# Altium project Expansion_S6.PrjPcb
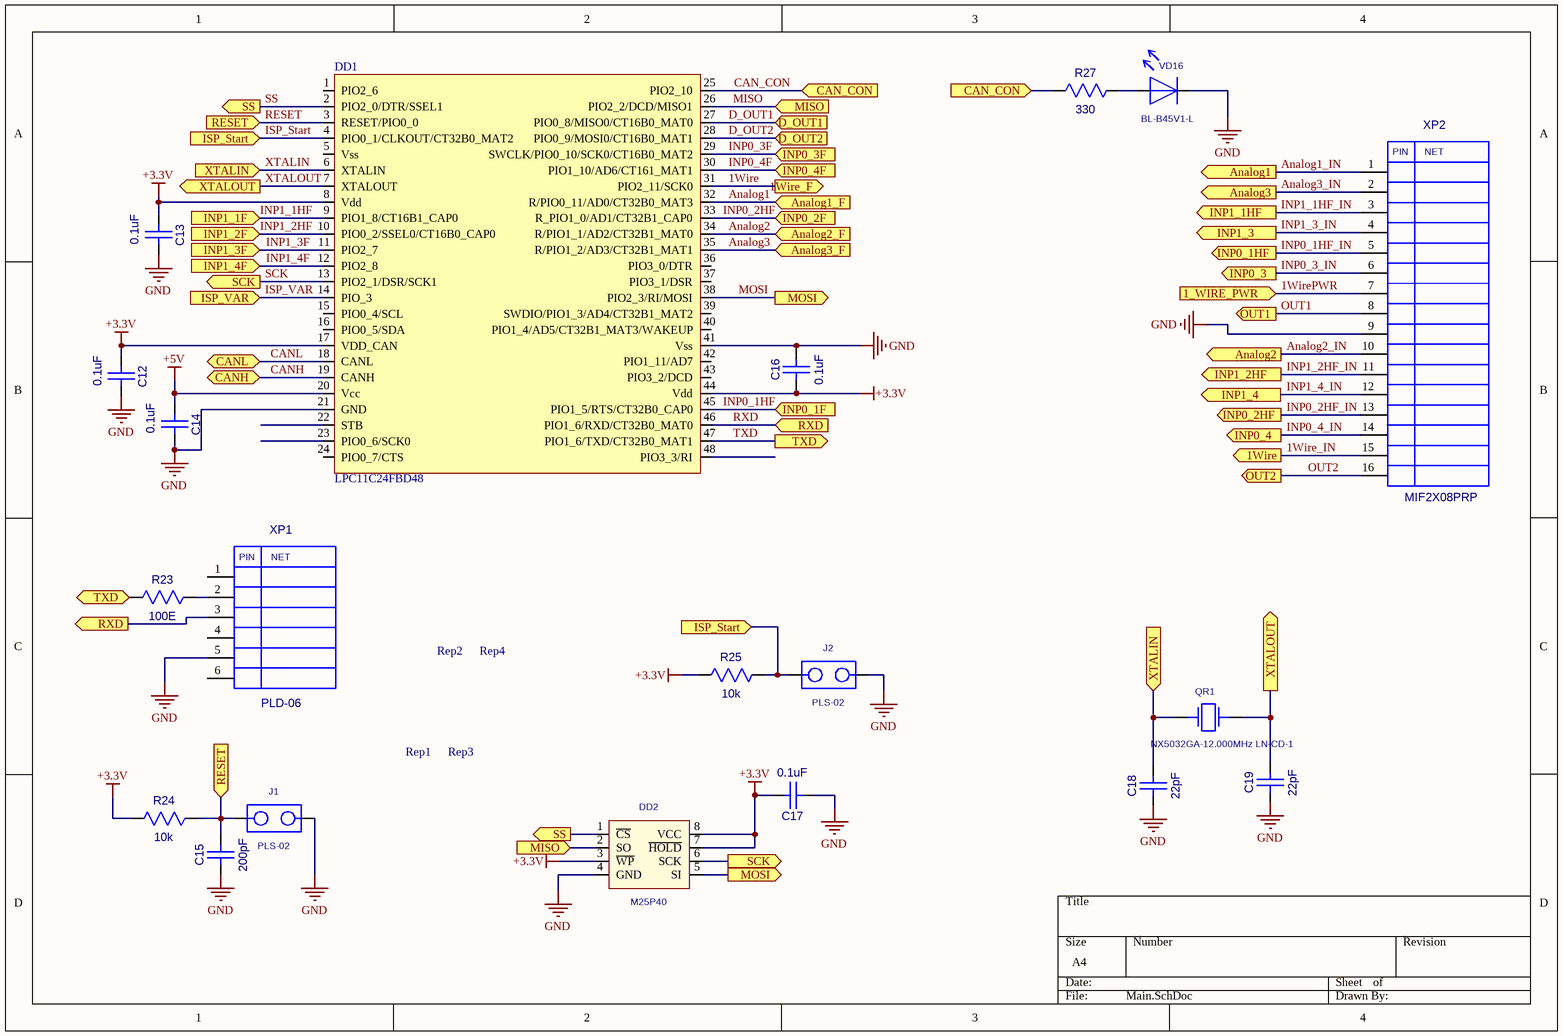
[diagram p0: Main.SchDoc]
6 sheets, 127 parts. Net scope: flat (ports and power ports of the same name join across sheets).
Board file: ExpansionS6_PCB.PcbDoc
Sheets:
  Main.SchDoc
  Power.SchDoc
  Input.SchDoc
  Input_1.SchDoc
  Input_0.SchDoc
  Output&1Wire.SchDoc

## Sheet Main.SchDoc
size A4

### Parts
C12  0.1uF  [CC0603-3M]
C13  0.1uF  [CC0603-3M]
C14  0.1uF  [CC0603-3M]
C15  200pF  [CC0603-3M]
C16  0.1uF  [CC0603-3M]
C17  0.1uF  [CC0603-3M]
C18  22pF  [CC0603-3M]
C19  22pF  [CC0603-3M]
DD1  LPC11C24FBD48  [LQFP48]
DD2  M25P40  [EIAJ_SO8]
J1  PLS-02  [PIN2W]
J2  PLS-02  [PIN2W]
QR1  NX5032GA-12.000MHz LN-CD-1  [AC5032_2]
R23  100E  [RC0603-3M]
R24  10k  [RC0603-3M]
R25  10k  [RC0603-3M]
R27  330  [RC0603-3M]
Rep1  REPER1.2  [REPER1.2]  (value not drawn)
Rep2  REPER1.2  [REPER1.2]  (value not drawn)
Rep3  REPER1.2  [REPER1.2]  (value not drawn)
Rep4  REPER1.2  [REPER1.2]  (value not drawn)
VD16  BL-B45V1-L  [LED3]
XP1  PLD-06  [PIN6]
XP2  MIF2X08PRP  [MIF2X08PRP]

### Ports
1_WIRE_PWR (in), 1Wire (out), 1Wire_F (out), Analog1 (out), Analog1_F (in), Analog2 (out), Analog2_F (in), Analog3 (out), Analog3_F (in), CAN_CON (in), CANH, CANL, D_OUT1 (in), D_OUT2 (in), INP0_1F (in), INP0_1HF (out), INP0_2F (in), INP0_2HF (out), INP0_3 (out), INP0_3F (in), INP0_4 (out), INP0_4F (in), INP1_1F (in), INP1_1HF (out), INP1_2F (in), INP1_2HF (out), INP1_3 (out), INP1_3F (in), INP1_4 (out), INP1_4F (in), ISP_Start (in), ISP_VAR (in), MISO (in), MOSI (out), OUT1 (out), OUT2 (out), RESET (in), RXD (in), RXD (out), SCK (out), SS (out), TXD (in), TXD (out), XTALIN (in), XTALOUT (out)

### Nets
+3.3V: C12.1(A) C13.1(A) C16.1(A) C17.2(B) DD1.8(Vdd) DD1.17(VDD_CAN) DD1.44(Vdd) DD2.3(~{WP}) DD2.7(~{HOLD}) DD2.8(VCC) R24.1(A) R25.1(A)
+5V: C14.1(A) DD1.20(Vcc)
GND: C12.2(B) C13.2(B) C14.2(B) C15.1(A) C16.2(B) C17.1(A) C18.1(A) C19.1(A) DD1.21(GND) DD1.41(Vss) DD2.4(GND) J1.2 J2.2 VD16.1 XP1.5 XP2.9
1Wire: DD1.31(PIO2_11/SCK0) ; port 1Wire_F
1Wire_IN: XP2.15 ; port 1Wire
1WirePWR: XP2.7 ; port 1_WIRE_PWR
Analog1: DD1.32(R/PIO0_11/AD0/CT32B0_MAT3) ; port Analog1_F
Analog1_IN: XP2.1 ; port Analog1
Analog2: DD1.34(R/PIO1_1/AD2/CT32B1_MAT0) ; port Analog2_F
Analog2_IN: XP2.10 ; port Analog2
Analog3: DD1.35(R/PIO1_2/AD3/CT32B1_MAT1) ; port Analog3_F
Analog3_IN: XP2.2 ; port Analog3
CAN_CON: DD1.25(PIO2_10) R27.1(A) ; port CAN_CON
CANH: DD1.19(CANH) ; port CANH
CANL: DD1.18(CANL) ; port CANL
D_OUT1: DD1.27(PIO0_8/MISO0/CT16B0_MAT0) ; port D_OUT1
D_OUT2: DD1.28(PIO0_9/MOSI0/CT16B0_MAT1) ; port D_OUT2
INP0_1HF: DD1.45(PIO1_5/RTS/CT32B0_CAP0) ; port INP0_1F
INP0_1HF_IN: XP2.5 ; port INP0_1HF
INP0_2HF: DD1.33(R_PIO1_0/AD1/CT32B1_CAP0) ; port INP0_2F
INP0_2HF_IN: XP2.13 ; port INP0_2HF
INP0_3_IN: XP2.6 ; port INP0_3
INP0_3F: DD1.29(SWCLK/PIO0_10/SCK0/CT16B0_MAT2) ; port INP0_3F
INP0_4_IN: XP2.14 ; port INP0_4
INP0_4F: DD1.30(PIO1_10/AD6/CT161_MAT1) ; port INP0_4F
INP1_1HF: DD1.9(PIO1_8/CT16B1_CAP0) ; port INP1_1F
INP1_1HF_IN: XP2.3 ; port INP1_1HF
INP1_2HF: DD1.10(PIO0_2/SSEL0/CT16B0_CAP0) ; port INP1_2F
INP1_2HF_IN: XP2.11 ; port INP1_2HF
INP1_3_IN: XP2.4 ; port INP1_3
INP1_3F: DD1.11(PIO2_7) ; port INP1_3F
INP1_4_IN: XP2.12 ; port INP1_4
INP1_4F: DD1.12(PIO2_8) ; port INP1_4F
ISP_Start: DD1.4(PIO0_1/CLKOUT/CT32B0_MAT2) J2.1 R25.2(B) ; port ISP_Start
ISP_VAR: DD1.14(PIO_3) ; port ISP_VAR
MISO: DD1.26(PIO2_2/DCD/MISO1) DD2.2(SO) ; port MISO
MOSI: DD1.38(PIO2_3/RI/MOSI) DD2.5(SI) ; port MOSI
OUT1: XP2.8 ; port OUT1
OUT2: XP2.16 ; port OUT2
RESET: C15.2(B) DD1.3(RESET/PIO0_0) J1.1 R24.2(B) ; port RESET
RXD: DD1.46(PIO1_6/RXD/CT32B0_MAT0) XP1.3 ; port RXD
SCK: DD1.13(PIO2_1/DSR/SCK1) DD2.6(SCK) ; port SCK
SS: DD1.2(PIO2_0/DTR/SSEL1) DD2.1(~{CS}) ; port SS
TXD: DD1.47(PIO1_6/TXD/CT32B0_MAT1) R23.1(A) ; port TXD
XTALIN: C18.2(B) DD1.6(XTALIN) QR1.1 ; port XTALIN
XTALOUT: C19.2(B) DD1.7(XTALOUT) QR1.2 ; port XTALOUT
NetR23_2: R23.2(B) XP1.2
NetR27_2: R27.2(B) VD16.2

Not connected (* = marked no-connect by the designer): DD1 1(PIO2_6) 5(Vss) 15(PIO0_4/SCL) 16(PIO0_5/SDA) 22(STB) 23(PIO0_6/SCK0) 24(PIO0_7/CTS) 36(PIO3_0/DTR) 37(PIO3_1/DSR) 39(SWDIO/PIO1_3/AD4/CT32B1_MAT2) 40(PIO1_4/AD5/CT32B1_MAT3/WAKEUP) 42(PIO1_11/AD7) 43(PIO3_2/DCD) 48(PIO3_3/RI); Rep1 1; Rep2 1; Rep3 1; Rep4 1; XP1 1 4 6

### Notes on the sheet
- (in symbol MIF2X08PRP) PIN; NET
- (in symbol PLD-06) PIN; NET

### Library data of the parts
C12-C19 = CC0603
  C12-C14 C16 C17: Value: 0.1uF
  C15: Value: 200pF
  C18 C19: Value: 22pF
DD2 = S25FL016A0LMFI01: Value: M25P40
QR1 = AC5032_2: AC5032/2; Value: NX5032GA-12.000MHz LN-CD-1
R23-R25 R27 = RC0603
  R23: Value: 100E
  R24 R25: Value: 10k
  R27: Value: 330
VD16 = LED_3: Value: BL-B45V1-L
XP1 = PLD-06: PLD06; Value: *
DD1 = LPC11C24FBD48: Value: LPC11C24FBD48
J1 J2 = PLS-02: Value: *
Rep1-Rep4 = REPER1.2: Value: *
XP2 = MIF2X08PRP: Value: *

## Sheet Power.SchDoc
size A4
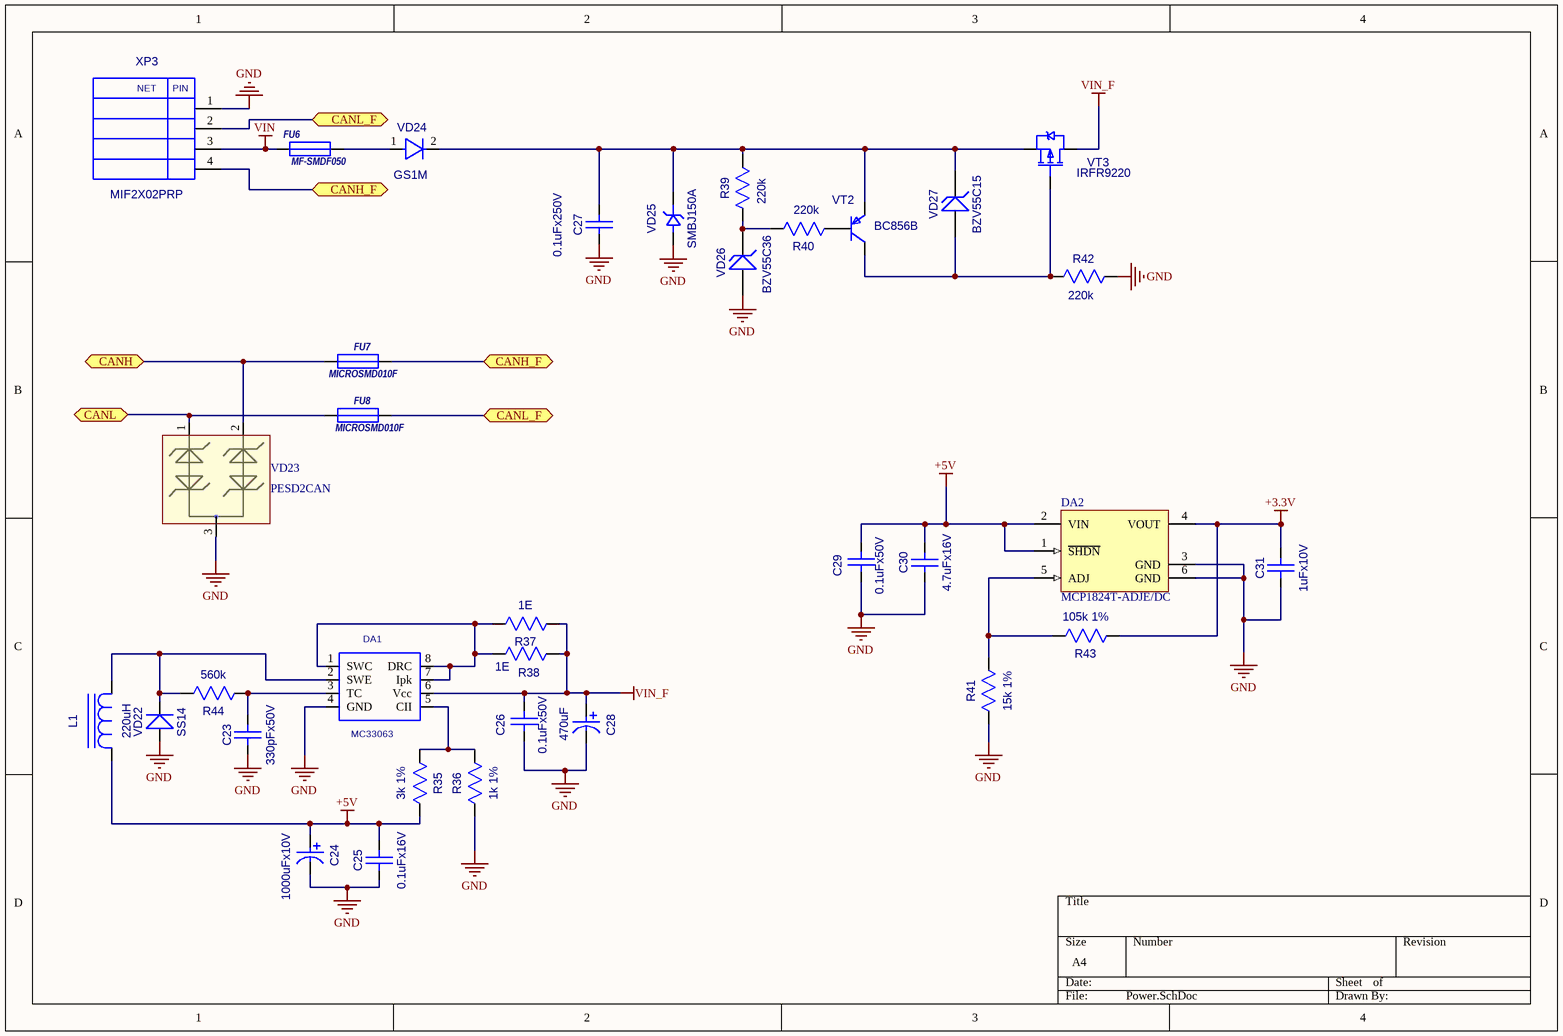
[diagram p1: Power.SchDoc]

### Parts
C23  330pFx50V  [CC0603-3M]
C24  1000uFx10V  [CC8X3.5]
C25  0.1uFx16V  [CC0603-3M]
C26  0.1uFx50V  [CC0603-3M]
C27  0.1uFx250V  [CC1206-MIDI]
C28  470uF  [CC16X10_CAP0.5(1)(Primary)]
C29  0.1uFx50V  [CC0603-3M]
C30  4.7uFx16V  [CC0805-MIDI-2M1]
C31  1uFx10V  [CC0603-3M]
DA1  MC33063  [SO-8]
DA2  MCP1824T-ADJE/DC  [SOT223-6]
FU6  MF-SMDF050  [MF-SMDF]
FU7  MICROSMD010F  [RC1210]
FU8  MICROSMD010F  [RC1210]
L1  220uH  [SDR0805]
R35  3k 1%  [RC0603-3M]
R36  1k 1%  [RC0603-3M]
R37  1E  [RC0805_IPC_NOM]
R38  1E  [RC0805_IPC_NOM]
R39  220k  [RC1206-2M]
R40  220k  [RC1206-2M]
R41  15k 1%  [RC0603-3M]
R42  220k  [RC1206-2M]
R43  105k 1%  [RC0603-3M]
R44  560k  [RC0603-3M]
VD22  SS14  [SMA]
VD23  PESD2CAN  [SOT-23(123)]
VD24  GS1M  [SMA]
VD25  SMBJ150A  [SMB]
VD26  BZV55C36  [SOD-80]
VD27  BZV55C15  [SOD-80]
VT2  BC856B  [SOT-23(123)]
VT3  IRFR9220  [D-PAK(TO-252AA)]
XP3  MIF2X02PRP  [MIF2X02PRP]

### Ports
CANH (bidir), CANH_F, CANH_F (bidir), CANL (bidir), CANL_F, CANL_F (bidir)

### Nets
+3.3V: C31.2(B) DA2.4(VOUT) R43.1(A)
+5V: C24.1 C25.2(B) C29.1(A) C30.2(B) DA2.1(~{SHDN}) DA2.2(VIN) L1.1(C) R35.2(B)
GND: C23.1(A) C24.2 C25.1(A) C26.2(B) C27.1(A) C28.1 C29.2(B) C30.1(A) C31.1(A) DA1.4(GND) DA2.3(GND) DA2.6(GND) R36.1(A) R41.1(A) R42.2(B) VD22.1(A) VD23.3 VD25.1(A) VD26.1(A) XP3.1
VIN: FU6.1 XP3.3
VIN_F: C26.1(A) C28.2 DA1.6(Vcc) R37.1(A) R38.1(A) VT3.3(D)
CANH: FU7.2 VD23.2 ; port CANH
CANL: FU8.2 VD23.1 ; port CANL
NetC23_2: C23.2(B) DA1.3(TC) R44.1(A)
NetC27_2: C27.2(B) R39.2(B) VD24.2(K) VD25.2(K) VD27.2 VT2.2(E) VT3.2(S)
NetDA1_1: DA1.1(SWC) DA1.7(Ipk) DA1.8(DRC) R37.2(B) R38.2(B)
NetDA1_2: DA1.2(SWE) L1.2(A) R44.2(B) VD22.2(K)
NetDA1_5: DA1.5(CII) R35.1(A) R36.2(B)
NetDA2_5: DA2.5(ADJ) R41.2(B) R43.2(B)
NetFU6_2: FU6.2 VD24.1(A)
NetFU7_1: FU7.1 XP3.4 ; port CANH_F
NetFU8_1: FU8.1 XP3.2 ; port CANL_F
NetR39_1: R39.1(A) R40.2(B) VD26.2
NetR40_1: R40.1(A) VT2.1(B)
NetR42_1: R42.1(A) VD27.1(A) VT2.3(C) VT3.1(G)

### Notes on the sheet
- (in symbol MIF2X02PRP) NET; PIN

### Library data of the parts
C23 C25 C26 C29 C31 = CC0603
  C23: Value: 330pFx50V
  C25: Value: 0.1uFx16V
  C26 C29: Value: 0.1uFx50V
  C31: Value: 1uFx10V
C24 = CAP0.35: Value: 1000uFx10V
C27 = CC1206: Value: 0.1uFx250V
C28 = CAP0.5(1): Value: 470uF
C30 = CC0805: Value: 4.7uFx16V
DA1 = MC34063: Value: MC33063
DA2 = MCP1824T-ADJE/DC: 300 mA, Low Voltage, Low Quiescent Current LDO Regulator, 5-Pin SOT-223, Extended Temperature, Tape and Reel; Published: 29-Jan-2009; DatasheetVersion: revA, Aug-2007; PackageVersion: revAW, Oct-2008; PackageReference: SOT-223-DC5; Publisher: Altium Limited; PackageDescription: 5-Lead Plastic Small Outline Transistor (DC) [SOT-223]; ComponentLink1Description: Manufacturer Link; ComponentLink1URL: http://www.microchip.com; ComponentLink2Description: Datasheet; ComponentLink2URL: http://ww1.microchip.com/downloads/en/DeviceDoc/22070a.pdf; ComponentLink3Description: Packaging Specification; ComponentLink3URL: http://ww1.microchip.com/downloads/en/PackagingSpec/00049AW.pdf
FU6 = MF-SMDF: Value: MF-SMDF050
FU7 FU8 = MICROSMD: Value: MICROSMD010F
L1 = SDR0805: Value: 220uH
R35 R36 R41 R43 R44 = RC0603
  R35: Value: 3k 1%
  R36: Value: 1k 1%
  R41: Value: 15k 1%
  R43: Value: 105k 1%
  R44: Value: 560k
R37 R38 = RC0805: Value: 1E
R39 R40 R42 = RC1206: Value: 220k
VD22 = SS14: Schottky Rectifier; Value: SS14
VD23 = PESD2CAN: TVS for CAN
VD24 = GS1M: Value: {Value}
VD25 = SMBJ: Value: SMBJ150A
VD26 VD27 = BZV55C12: Zener Voltage Regulator Diode; OriginalName: BZX84C10LT1; ComponentField6: Pin 2 is not connected and not drawn.; ComponentField7: Published 29-Sep-2000
  VD26: Value: BZV55C36
  VD27: Value: BZV55C15
VT2 = BC856B: OriginalName: BC856BLT; ComponentField7: Published 29-Sep-2000; Value: BC856B
VT3 = IRFR9220: HEXFET Power MOSFET; OriginalName: IRLML5103; ComponentField7: Published 8-Jun-2000; Value: IRFR9220
XP3 = MIF2X02PRP: Value: *

## Sheet Input.SchDoc
size A4
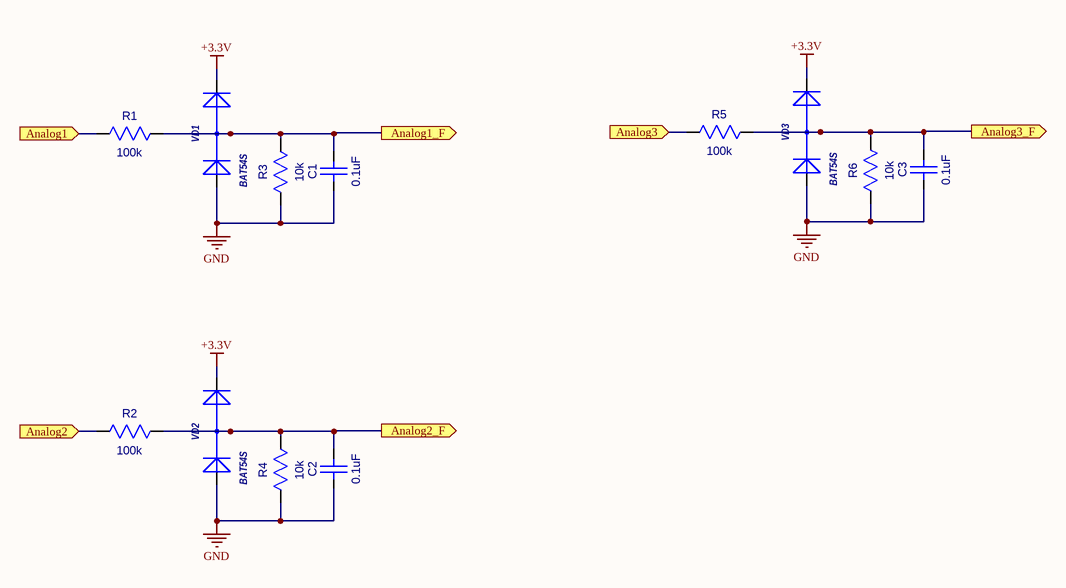
[diagram p2: Input.SchDoc]

### Parts
C1  0.1uF  [CC0603-3M]
C2  0.1uF  [CC0603-3M]
C3  0.1uF  [CC0603-3M]
R1  100k  [RC0603-3M]
R2  100k  [RC0603-3M]
R3  10k  [RC0603-3M]
R4  10k  [RC0603-3M]
R5  100k  [RC0603-3M]
R6  10k  [RC0603-3M]
VD1  BAT54S  [SOT-23(GSD)]
VD2  BAT54S  [SOT-23(GSD)]
VD3  BAT54S  [SOT-23(GSD)]

### Ports
Analog1 (in), Analog1_F (out), Analog2 (in), Analog2_F (out), Analog3 (in), Analog3_F (out)

### Nets
+3.3V: VD1.2(K) VD2.2(K) VD3.2(K)
GND: C1.1(A) C2.1(A) C3.1(A) R3.1(A) R4.1(A) R6.1(A) VD1.1(A) VD2.1(A) VD3.1(A)
Analog1: C1.2(B) R1.2(B) R3.2(B) VD1.3(AK) ; port Analog1_F
Analog1_IN: R1.1(A) ; port Analog1
Analog2: C2.2(B) R2.2(B) R4.2(B) VD2.3(AK) ; port Analog2_F
Analog2_IN: R2.1(A) ; port Analog2
Analog3: C3.2(B) R5.2(B) R6.2(B) VD3.3(AK) ; port Analog3_F
Analog3_IN: R5.1(A) ; port Analog3

### Library data of the parts
C1-C3 = CC0603: Value: 0.1uF
R1-R6 = RC0603
  R1 R2 R5: Value: 100k
  R3 R4 R6: Value: 10k
VD1-VD3 = BAT54S: 1.0 Ampere General Purpose Rectifier; ComponentField6: Published 8-Jun-2000, Modified 11-July-2000: SIM Model Added.; Value: *

## Sheet Input_1.SchDoc
size A4
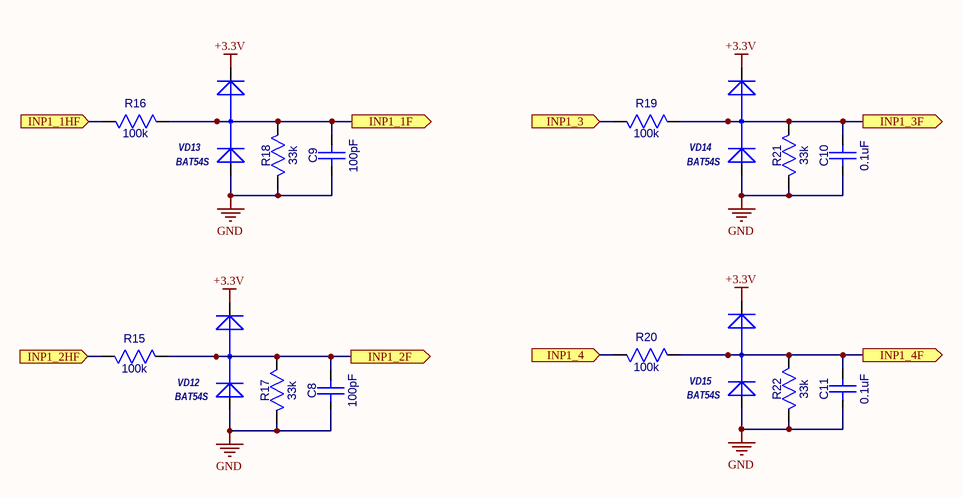
[diagram p3: Input_1.SchDoc]

### Parts
C8  100pF  [CC0603-3M]
C9  100pF  [CC0603-3M]
C10  0.1uF  [CC0603-3M]
C11  0.1uF  [CC0603-3M]
R15  100k  [RC0603-3M]
R16  100k  [RC0603-3M]
R17  33k  [RC0603-3M]
R18  33k  [RC0603-3M]
R19  100k  [RC0603-3M]
R20  100k  [RC0603-3M]
R21  33k  [RC0603-3M]
R22  33k  [RC0603-3M]
VD12  BAT54S  [SOT-23(GSD)]
VD13  BAT54S  [SOT-23(GSD)]
VD14  BAT54S  [SOT-23(GSD)]
VD15  BAT54S  [SOT-23(GSD)]

### Ports
INP1_1F (out), INP1_1HF (in), INP1_2F (out), INP1_2HF (in), INP1_3 (in), INP1_3F (out), INP1_4 (in), INP1_4F (out)

### Nets
+3.3V: VD12.2(K) VD13.2(K) VD14.2(K) VD15.2(K)
GND: C8.1(A) C9.1(A) C10.1(A) C11.1(A) R17.2(B) R18.2(B) R21.2(B) R22.2(B) VD12.1(A) VD13.1(A) VD14.1(A) VD15.1(A)
INP1_1HF: C9.2(B) R16.1(A) R18.1(A) VD13.3(AK) ; port INP1_1F
INP1_1HF_IN: R16.2(B) ; port INP1_1HF
INP1_2HF: C8.2(B) R15.1(A) R17.1(A) VD12.3(AK) ; port INP1_2F
INP1_2HF_IN: R15.2(B) ; port INP1_2HF
INP1_3_IN: R19.2(B) ; port INP1_3
INP1_3F: C10.2(B) R19.1(A) R21.1(A) VD14.3(AK) ; port INP1_3F
INP1_4_IN: R20.2(B) ; port INP1_4
INP1_4F: C11.2(B) R20.1(A) R22.1(A) VD15.3(AK) ; port INP1_4F

### Library data of the parts
C8-C11 = CC0603
  C8 C9: Value: 100pF
  C10 C11: Value: 0.1uF
R15-R22 = RC0603
  R15 R16 R19 R20: Value: 100k
  R17 R18 R21 R22: Value: 33k
VD12-VD15 = BAT54S: ComponentField6: Published 8-Jun-2000, Modified 11-July-2000: SIM Model Added.; Value: *

## Sheet Input_0.SchDoc
size A4
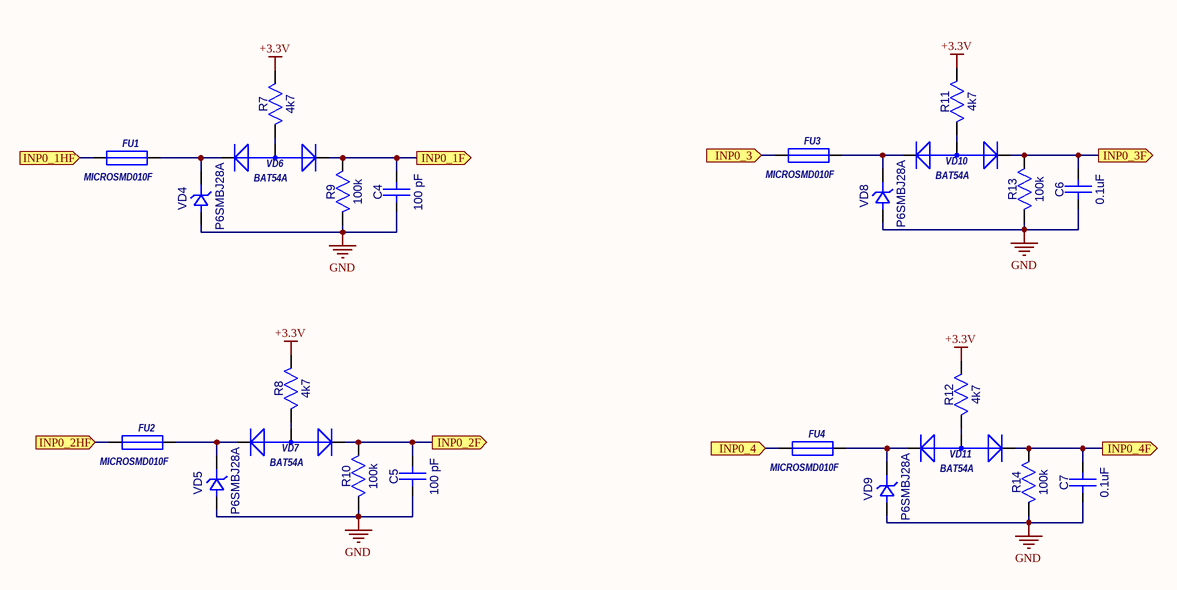
[diagram p4: Input_0.SchDoc]

### Parts
C4  100 pF  [CC0603-3M]
C5  100 pF  [CC0603-3M]
C6  0.1uF  [CC0603-3M]
C7  0.1uF  [CC0603-3M]
FU1  MICROSMD010F  [RC1210]
FU2  MICROSMD010F  [RC1210]
FU3  MICROSMD010F  [RC1210]
FU4  MICROSMD010F  [RC1210]
R7  4k7  [RC0603-3M]
R8  4k7  [RC0603-3M]
R9  100k  [RC0603-3M]
R10  100k  [RC0603-3M]
R11  4k7  [RC0603-3M]
R12  4k7  [RC0603-3M]
R13  100k  [RC0603-3M]
R14  100k  [RC0603-3M]
VD4  P6SMBJ28A  [SMB]
VD5  P6SMBJ28A  [SMB]
VD6  BAT54A  [SOT-23(123)]
VD7  BAT54A  [SOT-23(123)]
VD8  P6SMBJ28A  [SMB]
VD9  P6SMBJ28A  [SMB]
VD10  BAT54A  [SOT-23(123)]
VD11  BAT54A  [SOT-23(123)]

### Ports
INP0_1F (out), INP0_1HF (in), INP0_2F (out), INP0_2HF (in), INP0_3 (in), INP0_3F (out), INP0_4 (in), INP0_4F (out)

### Nets
+3.3V: R7.1(A) R8.1(A) R11.1(A) R12.1(A)
GND: C4.1(A) C5.1(A) C6.1(A) C7.1(A) R9.2(B) R10.2(B) R13.2(B) R14.2(B) VD4.1(A) VD5.1(A) VD8.1(A) VD9.1(A)
INP0_1HF: C4.2(B) R9.1(A) VD6.2(K) ; port INP0_1F
INP0_1HF_IN: FU1.2 ; port INP0_1HF
INP0_2HF: C5.2(B) R10.1(A) VD7.2(K) ; port INP0_2F
INP0_2HF_IN: FU2.2 ; port INP0_2HF
INP0_3_IN: FU3.2 ; port INP0_3
INP0_3F: C6.2(B) R13.1(A) VD10.2(K) ; port INP0_3F
INP0_4_IN: FU4.2 ; port INP0_4
INP0_4F: C7.2(B) R14.1(A) VD11.2(K) ; port INP0_4F
NetFU1_1: FU1.1 VD4.2(K) VD6.1(K)
NetFU2_1: FU2.1 VD5.2(K) VD7.1(K)
NetFU3_1: FU3.1 VD8.2(K) VD10.1(K)
NetFU4_1: FU4.1 VD9.2(K) VD11.1(K)
NetR7_2: R7.2(B) VD6.3(A)
NetR8_2: R8.2(B) VD7.3(A)
NetR11_2: R11.2(B) VD10.3(A)
NetR12_2: R12.2(B) VD11.3(A)

### Library data of the parts
C4-C7 = CC0603
  C4 C5: Value: 100 pF
  C6 C7: Value: 0.1uF
FU1-FU4 = MICROSMD: Value: MICROSMD010F
R7-R14 = RC0603
  R7 R8 R11 R12: Value: 4k7
  R9 R10 R13 R14: Value: 100k
VD4 VD5 VD8 VD9 = SMBJ: Value: P6SMBJ28A
VD6 VD7 VD10 VD11 = BAT54A: ComponentField6: Published 8-Jun-2000, Modified 11-July-2000: SIM Model Added.; Value: *

## Sheet Output&1Wire.SchDoc
size A4
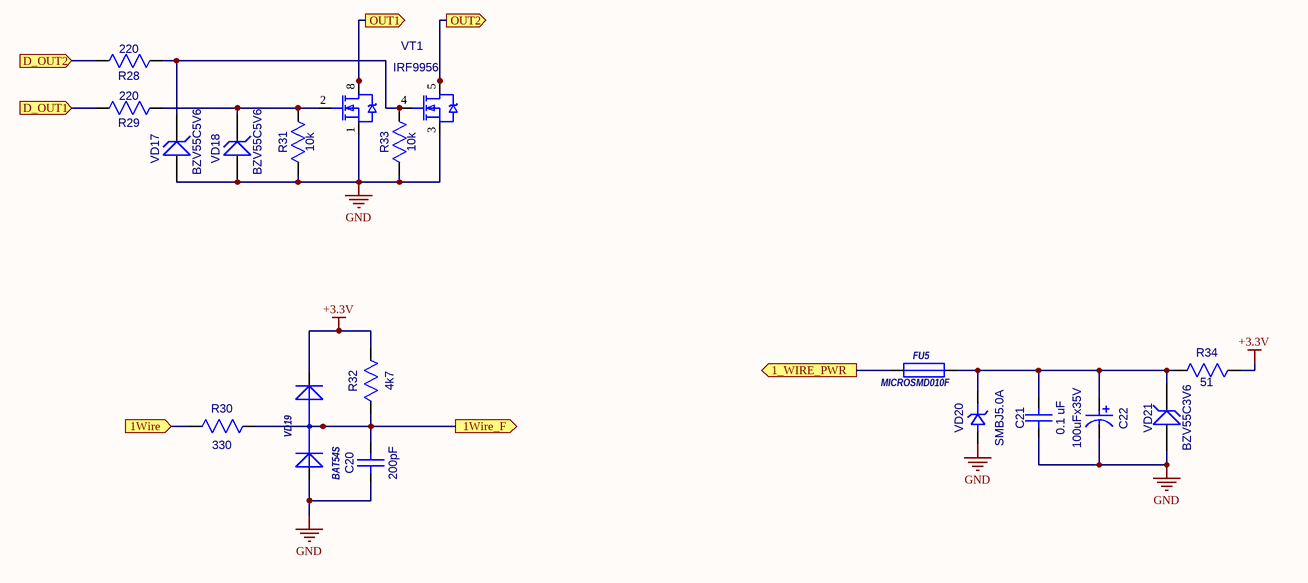
[diagram p5: Output&1Wire.SchDoc]

### Parts
C20  200pF  [CC0603-3M]
C21  0.1 uF  [CC0603-3M]
C22  100uFx35V  [CC20X2.54]
FU5  MICROSMD010F  [RC1210]
R28  220  [RC0603-3M]
R29  220  [RC0603-3M]
R30  330  [RC0603-3M]
R31  10k  [RC0603-3M]
R32  4k7  [RC0603-3M]
R33  10k  [RC0603-3M]
R34  51  [RC1206-2M]
VD17  BZV55C5V6  [SOD-80]
VD18  BZV55C5V6  [SOD-80]
VD19  BAT54S  [SOT-23(GSD)]
VD20  SMBJ5.0A  [SMB]
VD21  BZV55C3V6  [SOD-80]
VT1  IRF9956  [SO-8]

### Ports
1_WIRE_PWR (out), 1Wire (in), 1Wire_F (out), D_OUT1 (in), D_OUT2 (in), OUT1 (out), OUT2 (out)

### Nets
+3.3V: R32.2(B) R34.2(B) VD19.2(K)
GND: C20.1(A) C21.1(A) C22.2(minus) R31.2(B) R33.2(B) VD17.1(A) VD18.1(A) VD19.1(A) VD20.1(A) VD21.1(A) VT1.1(S) VT1.3(S)
1Wire: C20.2(B) R30.2(B) R32.1(A) VD19.3(AK) ; port 1Wire_F
1Wire_IN: R30.1(A) ; port 1Wire
1WirePWR: FU5.2 ; port 1_WIRE_PWR
D_OUT1: R29.1(A) ; port D_OUT1
D_OUT2: R28.1(A) ; port D_OUT2
OUT1: VT1.7(D) VT1.8(D) ; port OUT1
OUT2: VT1.5(D) VT1.6(D) ; port OUT2
NetC21_2: C21.2(B) C22.1(plus) FU5.1 R34.1(A) VD20.2(K) VD21.2
NetR28_2: R28.2(B) R33.1(A) VD17.2 VT1.4(G)
NetR29_2: R29.2(B) R31.1(A) VD18.2 VT1.2(G)

### Library data of the parts
C20 C21 = CC0603
  C20: Value: 200pF
  C21: Value: 0.1 uF
C22 = CAP0.25: Value: 100uFx35V
FU5 = MICROSMD: Value: MICROSMD010F
R28-R33 = RC0603
  R28 R29: Value: 220
  R30: Value: 330
  R31 R33: Value: 10k
  R32: Value: 4k7
R34 = RC1206: Value: 51
VD17 VD18 = BZV55C3V0: OriginalName: BZX84C10LT1; ComponentField6: Pin 2 is not connected and not drawn.; ComponentField7: Published 29-Sep-2000; Value: BZV55C5V6
VD19 = BAT54S: as VD1 on sheet Input; Value: *
VD20 = SMBJ: Value: SMBJ5.0A
VD21 = BZV55C12: OriginalName: BZX84C10LT1; ComponentField6: Pin 2 is not connected and not drawn.; ComponentField7: Published 29-Sep-2000; Value: BZV55C3V6
VT1 = IRF9956: OriginalName: IRLML2402; ComponentField7: Published 8-Jun-2000

## Nets that join several sheets
+3.3V: Main (12 pins), Power (C31.2 DA2.4 R43.1), Input (VD1.2 VD2.2 VD3.2), Input_1 (VD12.2 VD13.2 VD14.2 VD15.2), Input_0 (R7.1 R8.1 R11.1 R12.1), Output&1Wire (R32.2 R34.2 VD19.2)
+5V: Main (C14.1 DD1.20), Power (8 pins)
GND: Main (16 pins), Power (20 pins), Input (9 pins), Input_1 (12 pins), Input_0 (12 pins), Output&1Wire (12 pins)
1Wire: Main (DD1.31), Output&1Wire (C20.2 R30.2 R32.1 VD19.3)
1Wire_IN: Main (XP2.15), Output&1Wire (R30.1)
1WirePWR: Main (XP2.7), Output&1Wire (FU5.2)
Analog1: Main (DD1.32), Input (C1.2 R1.2 R3.2 VD1.3)
Analog1_IN: Main (XP2.1), Input (R1.1)
Analog2: Main (DD1.34), Input (C2.2 R2.2 R4.2 VD2.3)
Analog2_IN: Main (XP2.10), Input (R2.1)
Analog3: Main (DD1.35), Input (C3.2 R5.2 R6.2 VD3.3)
Analog3_IN: Main (XP2.2), Input (R5.1)
CANH: Main (DD1.19), Power (FU7.2 VD23.2)
CANL: Main (DD1.18), Power (FU8.2 VD23.1)
D_OUT1: Main (DD1.27), Output&1Wire (R29.1)
D_OUT2: Main (DD1.28), Output&1Wire (R28.1)
INP0_1HF: Main (DD1.45), Input_0 (C4.2 R9.1 VD6.2)
INP0_1HF_IN: Main (XP2.5), Input_0 (FU1.2)
INP0_2HF: Main (DD1.33), Input_0 (C5.2 R10.1 VD7.2)
INP0_2HF_IN: Main (XP2.13), Input_0 (FU2.2)
INP0_3_IN: Main (XP2.6), Input_0 (FU3.2)
INP0_3F: Main (DD1.29), Input_0 (C6.2 R13.1 VD10.2)
INP0_4_IN: Main (XP2.14), Input_0 (FU4.2)
INP0_4F: Main (DD1.30), Input_0 (C7.2 R14.1 VD11.2)
INP1_1HF: Main (DD1.9), Input_1 (C9.2 R16.1 R18.1 VD13.3)
INP1_1HF_IN: Main (XP2.3), Input_1 (R16.2)
INP1_2HF: Main (DD1.10), Input_1 (C8.2 R15.1 R17.1 VD12.3)
INP1_2HF_IN: Main (XP2.11), Input_1 (R15.2)
INP1_3_IN: Main (XP2.4), Input_1 (R19.2)
INP1_3F: Main (DD1.11), Input_1 (C10.2 R19.1 R21.1 VD14.3)
INP1_4_IN: Main (XP2.12), Input_1 (R20.2)
INP1_4F: Main (DD1.12), Input_1 (C11.2 R20.1 R22.1 VD15.3)
OUT1: Main (XP2.8), Output&1Wire (VT1.7 VT1.8)
OUT2: Main (XP2.16), Output&1Wire (VT1.5 VT1.6)